# Altium schematic sheet 780-00055, rev2, Pg2, SCH, NRES Temp Meas, 8-Chan RTD .SchDoc
size B; PageSetup: Record=PageOptions|CenterHorizontal=True|CenterVertical=True|PrintScale=1.12|XCorrection=1.00|YCorrection=1.00|PrintKind=0|BorderSize=5000000|LeftOffset=0|BottomOffset=0|Orientation=2|PaperLength=1000|PaperWidth=1000|Scale=100|PaperSource=15|PrintQuality=600|MediaType=1|DitherType=10|PrintScaleMode=1|PaperKind=Tabloid|PaperIndex=3
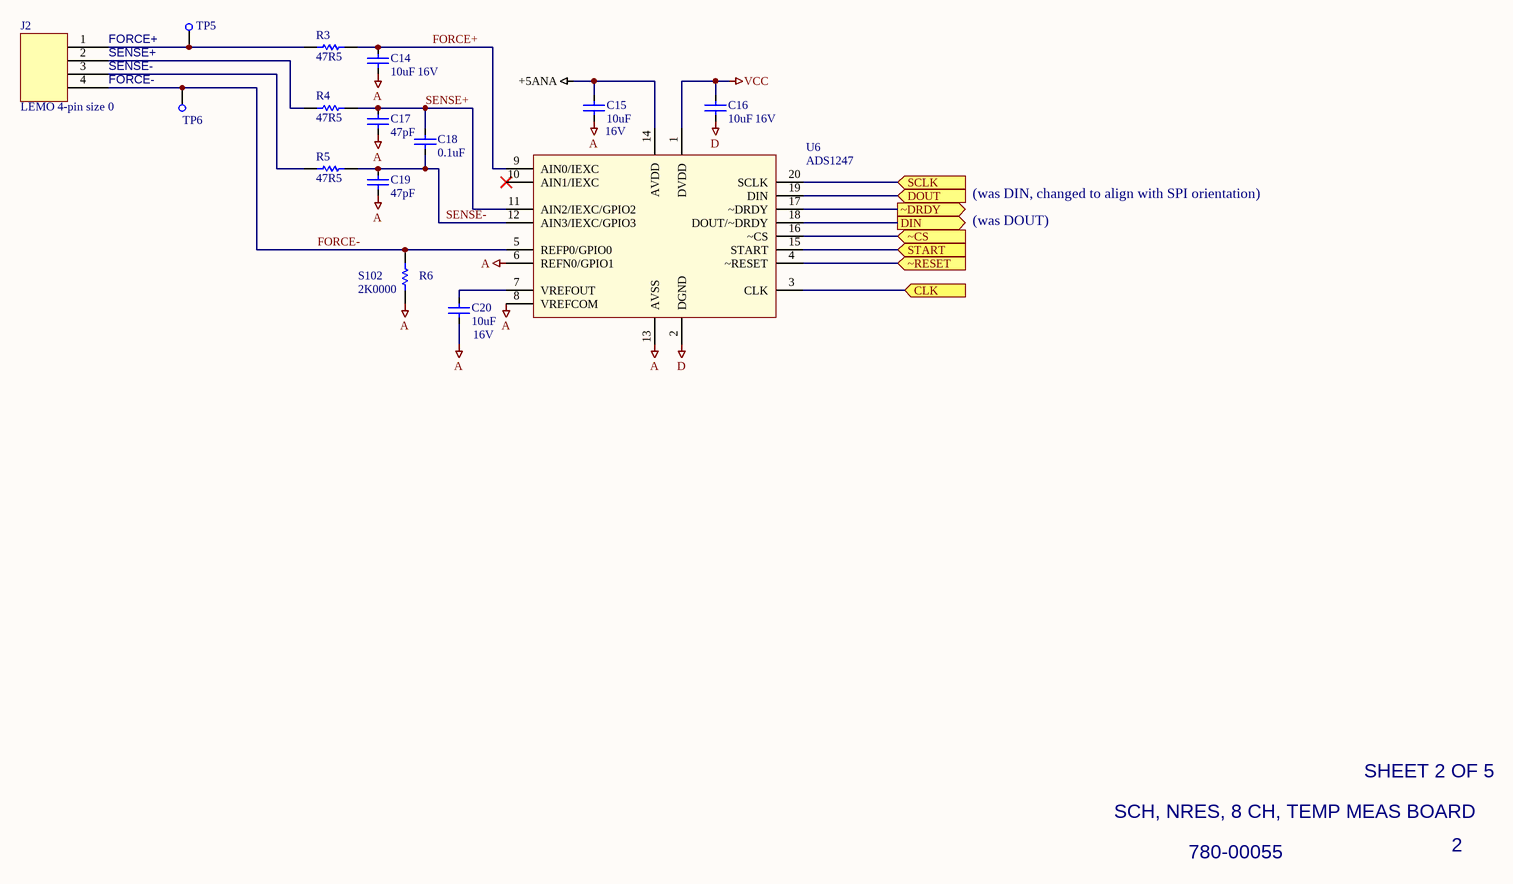
[diagram p0: 780-00055, rev2, Pg2, SCH, NRES Temp Meas, 8-Chan RTD .SchDoc]

## Parts
C14  16V  value 10uF  [SMD_0805]
C15  16V  value 10uF  [SMD_0805]
C16  16V  value 10uF  [SMD_0805]
C17  value 47pF  [SMD_0805]  (hidden comment: Cap SMD)
C18  value 0.1uF  [SMD_0805]  (hidden comment: Cap SMD)
C19  value 47pF  [SMD_0805]  (hidden comment: Cap SMD)
C20  16V  value 10uF  [SMD_0805]
J2  LEMO 4-pin size 0  [LEMO Size 0, 4-pin PCB]
R3  value 47R5  [SMD_0805]  (hidden comment: Res 0805)
R4  value 47R5  [SMD_0805]  (hidden comment: Res 0805)
R5  value 47R5  [SMD_0805]  (hidden comment: Res 0805)
R6  S102  value 2K0000  [Vishay S102 series]
TP5  Test point  [PAD_80D_052H]  (value not drawn)
TP6  Test point  [PAD_80D_052H]  (value not drawn)
U6  ADS1247  [TSSOP20]

## Ports
CLK (in), DIN (out), DOUT (in), SCLK (in), START (in), ~CS (in), ~DRDY (out), ~RESET (in)

## Nets
+5ANA: C15.2 U6.14(AVDD)
A: C14.1 C15.1 C17.1 C19.1 C20.1 R6.1 U6.6(REFN0/GPIO1) U6.8(VREFCOM) U6.13(AVSS)
D: C16.1 U6.2(DGND)
VCC: C16.2 U6.1(DVDD)
CLK: U6.3(CLK) ; port CLK
DIN: U6.18(DOUT/~DRDY) ; port DIN
DOUT: U6.19(DIN) ; port DOUT
FORCE+: C14.2 R3.2 U6.9(AIN0/IEXC)
FORCE-: J2.4(S32) R6.2 TP6.1(TP) U6.5(REFP0/GPIO0)
SCLK: U6.20(SCLK) ; port SCLK
SENSE+: C17.2 C18.2 R4.2 U6.11(AIN2/IEXC/GPIO2)
SENSE-: C18.1 C19.2 R5.2 U6.12(AIN3/IEXC/GPIO3)
START: U6.15(START) ; port START
~CS: U6.16(~CS) ; port ~CS
~DRDY: U6.17(~DRDY) ; port ~DRDY
~RESET: U6.4(~RESET) ; port ~RESET
NetC20_2: C20.2 U6.7(VREFOUT)
NetJ2_1: J2.1(S29) R3.1 TP5.1(TP)
NetJ2_2: J2.2(S30) R4.1
NetJ2_3: J2.3(S31) R5.1

Not connected (* = marked no-connect by the designer): U6 10(AIN1/IEXC)*

## Notes on the sheet
- FORCE+
- SENSE+
- SENSE-
- FORCE-
- (was DIN, changed to align with SPI orientation)
- (was DOUT)
- SCH, NRES, 8 CH, TEMP MEAS BOARD
- SHEET 2 OF 5
- 780-00055
- 2

## Library data of the parts
C14-C16 C20 = Cap SMD: Capacitor; LCO p/n: 120-00007
C17 C19 = Cap SMD: Capacitor; LCO p/n: 120-00056
C18 = Cap SMD: Capacitor; LCO p/n: 120-00002
J2 = LEMO Size 0, 4 pin, PCB: LCO p/n: 125-00372
R3-R5 = Res SMD: Resistor 0805; Manufacturer: Vishay/Dale; Manuf p/n: CRCW080547R5FKEA; Vendor: DIGIKEY; Vendor p/n: 541-47R5CCT-ND; Vendor Mult.: 10; LCO p/n: 181-047R5; COST: 0.09
R6 = RES TH Radial: Vishay Foil Resistor; LCO p/n: 180-00011
TP5 TP6 = Test point: Manufacturer: Keystone; Manuf p/n: 1249; Vendor: Bisco Ind.; LCO p/n: 125-00013; Vendor p/n: 1249; COST: 0.18; VALUE: Test point
U6 = ADS1247: 24bit ADC for Temp Sensors; Manufacturer: TI; Manuf p/n: ADS1247IPW; LCO p/n: 150-00106; Vendor: DK; Vendor p/n: 296-24293-5-ND